# EAGLE design ArduitsyR3 (EAGLE 8.0.0)
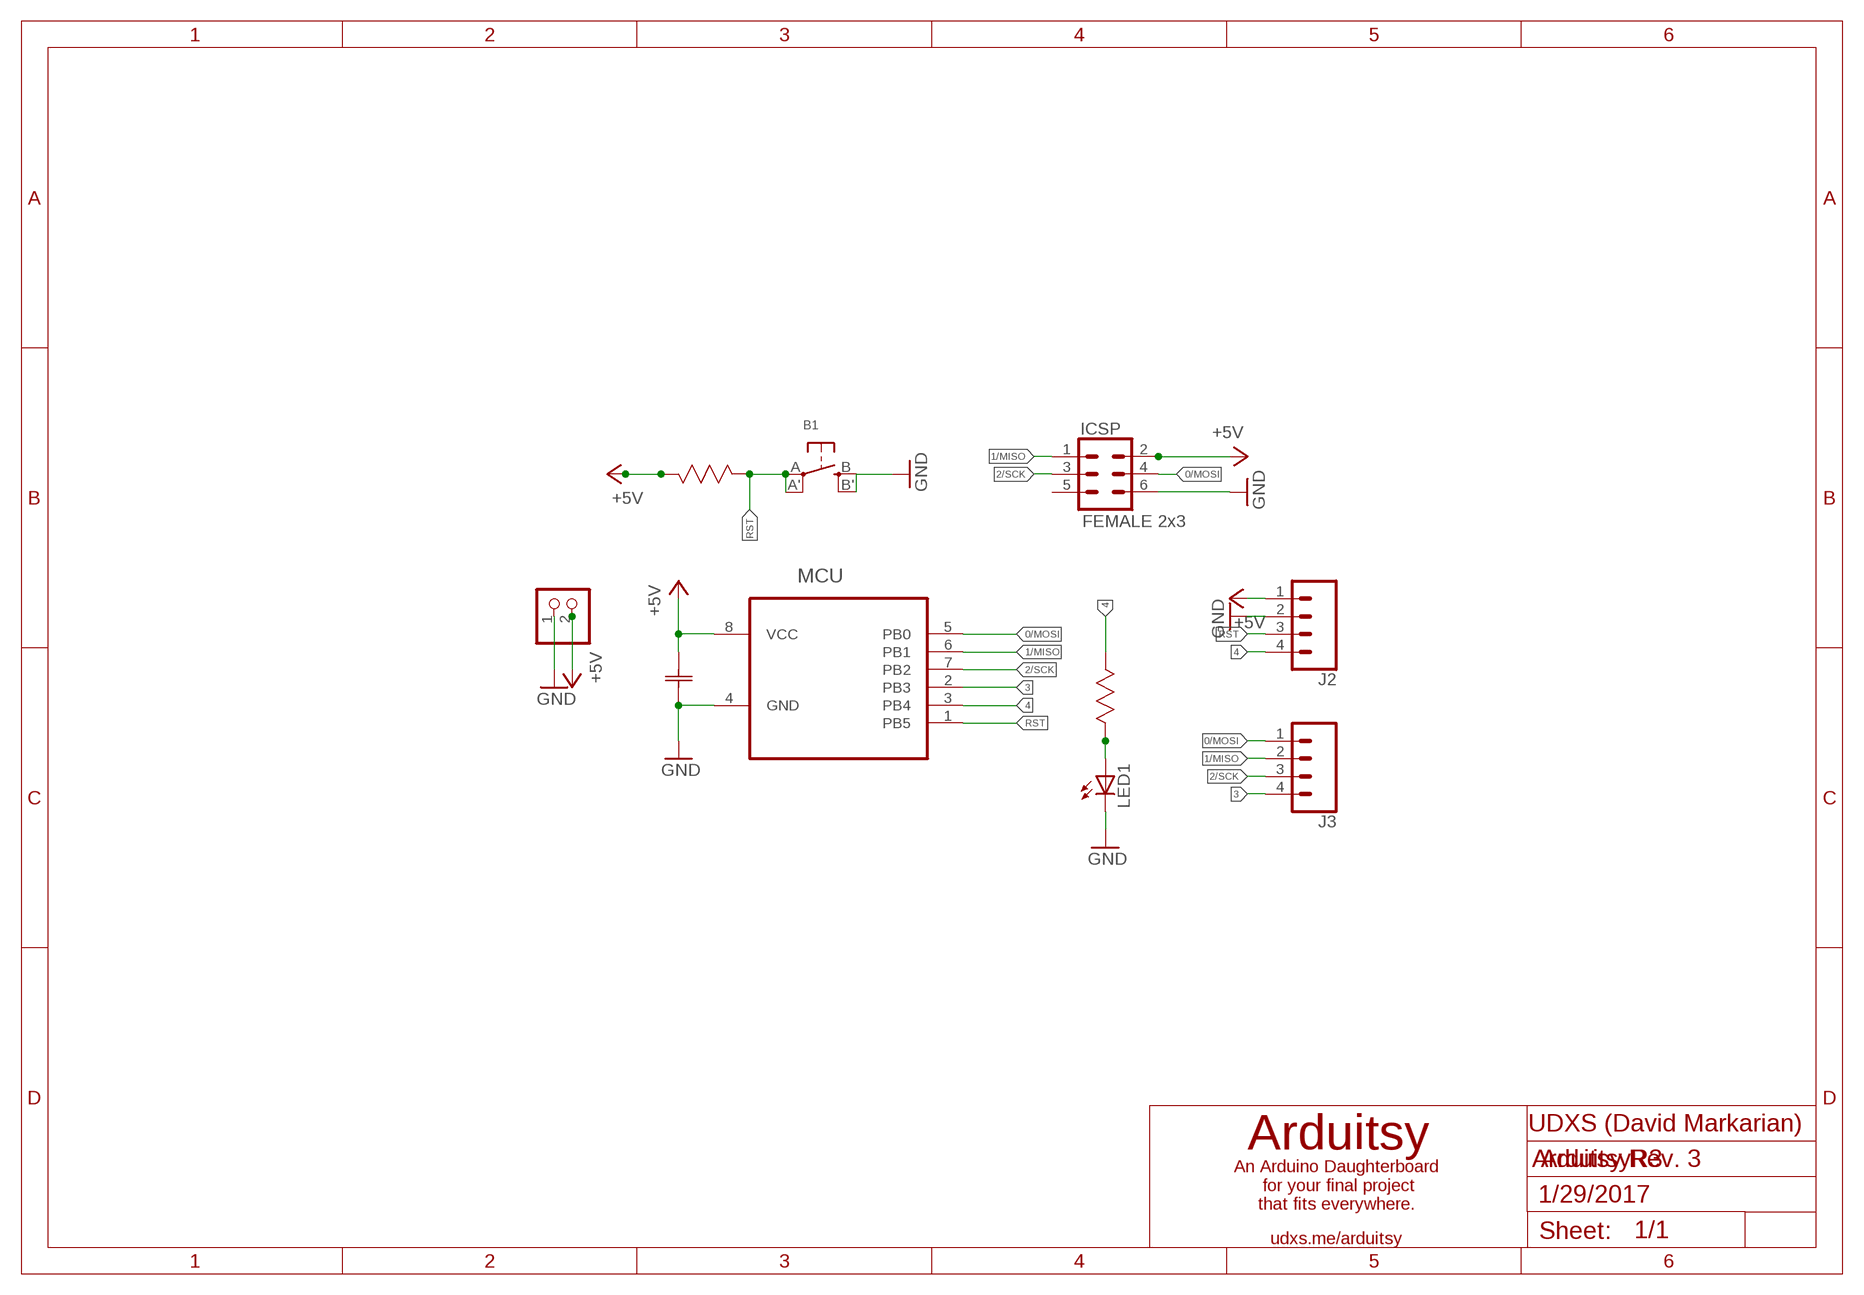
[diagram p0: schematic, sheet 1]

## Parts
B1  SWITCH_TACT_SMT  [EVQ-Q2]
C1  0.1µF  0805YC104KAT4A  [CAPC2012X94N]
CN1  JST_2PIN  [JSTPH2]
ICSP  FEMALE 2x3  CONN_03X2FEMALE  [2X3]
J2  CONN_04  [1X04]
J3  CONN_04  [1X04]
LED1  LEDCHIPLED_0805  [CHIPLED_0805]
MCU  ATTINY85-20SU  [SOIC127P798X216-8N]
R1  10K Ohms  MC0.1W08051%10K  [RESC2013X65N]
R2  10K Ohms  MC0.1W08051%10K  [RESC2013X65N]

## Nets
0/MOSI: ICSP.4 J3.1 MCU.5(PB0)
1/MISO: ICSP.1 J3.2 MCU.6(PB1)
2/SCK: ICSP.3 J3.3 MCU.7(PB2)
3: J3.4 MCU.2(PB3)
4: J2.4 MCU.3(PB4) R2.1(R1)
+5V: C1.1(C1) CN1.2 ICSP.2 J2.1 MCU.8(VCC) R1.1(R1)
GND: B1.B'(S1) B1.B(S) C1.2(C2) CN1.1 ICSP.6 J2.2 LED1.C MCU.4(GND)
N$1: LED1.A R2.2(R2)
RST: B1.A'(P1) B1.A(P) J2.3 MCU.1(PB5) R1.2(R2)
Unconnected: ICSP.5

## Notes on the sheet
- UDXS (David Markarian)
- Arduitsy
- Arduitsy Rev. 3
- An Arduino Daughterboard
   for your final project
  that fits everywhere.
- 1/29/2017
- udxs.me/arduitsy

## Library data of the parts
B1 = microbuilder:SWITCH_TACT_SMT: SMT Tact Switches 6x6mm - Digikey: P12940SCT-ND KMR2 (4.6x2.8mm) - Digikey: 401-1426-1-ND EVQ-PQHB55 - Light Touch, 160GF (4.5x4.5mm) - Digikey: P8090SCT-ND
C1 = AVX_By_element14_Batch_1:0805YC104KAT4A: Capacitor 0805; MPN: 0805YC104KAT4A; OC_FARNELL: -; OC_NEWARK: 30H0642; SUPPLIER: AVX; TOLERANCE: ±10%; VOLTAGERATING: 16V
CN1 = microbuilder:JST_2PIN: JST 2-Pin Right-Angle Connector PH-Series - 4UConnector: 17311 SH-Series - 4UConnector: 07278
ICSP = SparkFun-Connectors:CONN_03X2: Multi connection point. Often used as Generic Header-pin footprint for 0.1 inch spaced/style header connections You can populate with any combo of single row headers, but if you'd like an exact match, check these: Header - 2x3 (Male, 0.1") <https://www.sparkfun.com/products/12807> (PRT-12807) Header - 2x3 (Female, 0.1") <https://www.sparkfun.com/products/13010> (PRT-13010) 2x3 Pin Shrouded Header <https://www.sparkfun.com/products/10877> (PRT-10877) On any of the 0.1 inch spaced packages, you can populate with these: Break Away Headers - Straight <https://www.sparkfun.com/products/116> (PRT-00116) Break Away Male Headers - Right Angle <https://www.sparkfun.com/products/553> (PRT-00553) Female Headers <https://www.sparkfun.com/products/115> (PRT-00115) Break Away Headers - Machine Pin <https://www.sparkfun.com/products/117> (PRT-00117) Break Away Female Headers - Swiss Machine Pin <https://www.sparkfun.com/products/743> (PRT-00743) Special note: the shrouded connector mates well with our 3x2 ribbon cables: Ribbon Crimp Connector - 6-pin (2x3, Female) <https://www.sparkfun.com/products/10651> (PRT-10651) Ribbon Cable - 6 wire (15ft) <https://www.sparkfun.com/products/10646> (PRT-10646); PROD_ID: CONN-11566
J2 J3 = SparkFun-Connectors:CONN_04: Multi connection point. Often used as Generic Header-pin footprint for 0.1 inch spaced/style header connections On any of the 0.1 inch spaced packages, you can populate with these: Break Away Headers - Straight <https://www.sparkfun.com/products/116> (PRT-00116) Break Away Male Headers - Right Angle <https://www.sparkfun.com/products/553> (PRT-00553) Female Headers <https://www.sparkfun.com/products/115> (PRT-00115) Break Away Headers - Machine Pin <https://www.sparkfun.com/products/117> (PRT-00117) Break Away Female Headers - Swiss Machine Pin <https://www.sparkfun.com/products/743> (PRT-00743) For SCREWTERMINALS and SPRING TERMINALS visit here: Screw Terimnals on SparkFun.com <https://www.sparkfun.com/search/results?term=Screw+Terminals> (5mm/3.5mm/2.54mm spacing) This device is also useful as a general connection point to wire up your design to another part of your project. Our various solder wires solder well into these plated through hole pads. Hook-Up Wire - Assortment (Stranded, 22 AWG) <https://www.sparkfun.com/products/11375> (PRT-11375) Hook-Up Wire - Assortment (Solid Core, 22 AWG) <https://www.sparkfun.com/products/11367> (PRT-11367) View the entire wire category on our website here <https://www.sparkfun.com/categories/141> Special notes: Molex polarized connector foot print use with SKU : PRT-08231 with associated crimp pins and housings. 1MM SMD Version SKU: PRT-10208; PROD_ID: CONN-09696
LED1 = adafruit:LED: LED OSRAM: - CHIPLED LG R971, LG N971, LY N971, LG Q971, LY Q971, LO R971, LY R971 LH N974, LH R974 LS Q976, LO Q976, LY Q976 LO Q996 - Hyper CHIPLED LW Q18S LB Q993, LB Q99A, LB R99A - SideLED LS A670, LO A670, LY A670, LG A670, LP A670 LB A673, LV A673, LT A673, LW A673 LH A674 LY A675 LS A676, LA A676, LO A676, LY A676, LW A676 LS A679, LY A679, LG A679 - Hyper Micro SIDELED® LS Y876, LA Y876, LO Y876, LY Y876 LT Y87S - SmartLED LW L88C, LW L88S LB L89C, LB L89S, LG L890 LS L89K, LO L89K, LY L89K LS L896, LA L896, LO L896, LY L896 - TOPLED LS T670, LO T670, LY T670, LG T670, LP T670 LSG T670, LSP T670, LSY T670, LOP T670, LYG T670 LG T671, LOG T671, LSG T671 LB T673, LV T673, LT T673, LW T673 LH T674 LS T676, LA T676, LO T676, LY T676, LB T676, LH T676, LSB T676, LW T676 LB T67C, LV T67C, LT T67C, LS T67K, LO T67K, LY T67K, LW E67C LS E67B, LA E67B, LO E67B, LY E67B, LB E67C, LV E67C, LT E67C LW T67C LS T679, LY T679, LG T679 LS T770, LO T770, LY T770, LG T770, LP T770 LB T773, LV T773, LT T773, LW T773 LH T774 LS E675, LA E675, LY E675, LS T675 LS T776, LA T776, LO T776, LY T776, LB T776 LHGB T686 LT T68C, LB T68C - Hyper Mini TOPLED® LB M676 - Mini TOPLED Santana® LG M470 LS M47K, LO M47K, LY M47K Source: http://www.osram.convergy.de/
MCU = Atmel_By_element14_Batch_1-00:ATTINY85-20SU: 8-bit Microcontroller with In-System Programmable Flash; MPN: ATTINY85-20SU; OC_FARNELL: 1455164; OC_NEWARK: 58M3797; PACKAGE: SOIC-8; SUPPLIER: Atmel
R1 R2 = Multicomp_By_element14_Batch_1:MC0.1W08051%10K: RESISTOR, 0805; MPN: MC0.1W08051%10K; OC_FARNELL: 9332391; OC_NEWARK: -; SUPPLIER: Multicomp; TOLERANCE: ±1%; WATTAGE: 1/10 W

## Board
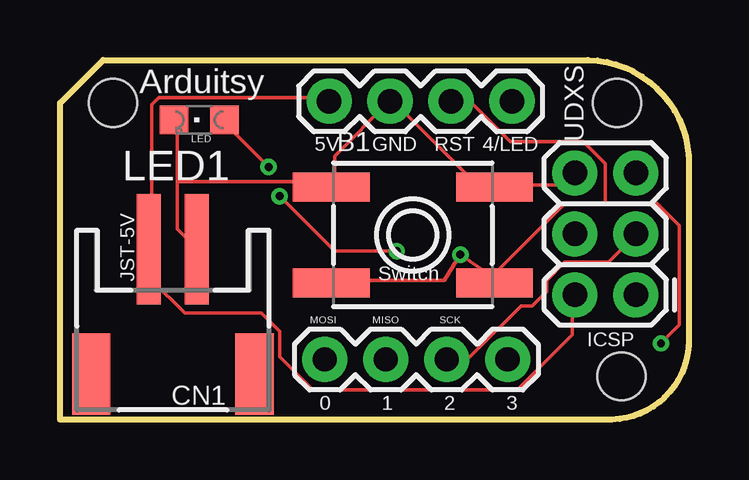
[diagram p1: board, top side]
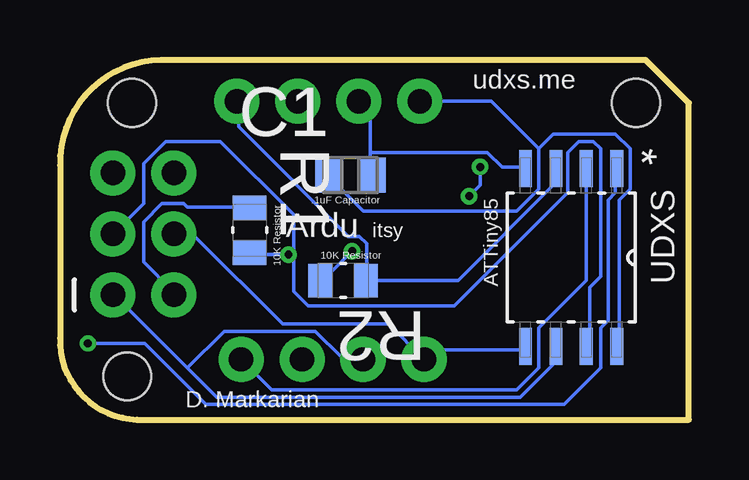
[diagram p2: board, bottom side, seen from below]

Size 26.2 x 15 mm. Coordinates in mm from the lower left corner, seen from the top.
Outline: 22,15 arc-90 26.2,10.6 26.2,3.4 arc-90 23,0 0,0 0,13.2 1.8,15 22,15
Copper layers (1*16): Top 0.0356mm / dielectric 1.5011mm / Bottom 0.0356mm
Design rules "PCBs_io": minimum track width 6mil, minimum drill 13mil, track to track 6mil, track to pad 6mil, pad to pad 6mil, via to via 6mil, smd to smd 6mil, copper to edge 15mil, drill to drill 6mil, minimum pad ring 7mil, minimum via ring 7mil, stop-mask expansion 3mil, vias tented up to drill 0mil, thermal gap 10mil
Holes 2 mm at 2.2,13.2 23.2,13.2 23.4,1.8

### Footprints (pad centres in the part's own frame; a part is rotated, then mirrored left to right if it is on the bottom)
EVQ-Q2 = smd 3.2 x 1.2: A -3.4,-2; A' 3.4,-2; B -3.4,2; B' 3.4,2
CAPC2012X94N = smd 1.118 x 1.448: 1 -0.914,0; 2 0.914,0
JSTPH2 = smd 1 x 4.6: 1 -1,-3.7; 2 1,-3.7 | smd 1.6 x 3.4: NC1 -3.4,1.5; NC2 3.4,1.5
2X3 = drill 1.016 pad 1.88: 1 0,0; 2 0,2.54; 3 2.54,0; 4 2.54,2.54; 5 5.08,0; 6 5.08,2.54
1X04 = drill 1.016 pad 1.88: 1 0,0; 2 2.54,0; 3 5.08,0; 4 7.62,0
CHIPLED_0805 = smd 1.2 x 1.2: A 0,-1.05; C 0,1.05
SOIC127P798X216-8N = smd 1.549 x 0.533: 1 -3.708,1.905; 2 -3.708,0.635; 3 -3.708,-0.635; 4 -3.708,-1.905; 5 3.708,-1.905; 6 3.708,-0.635; 7 3.708,0.635; 8 3.708,1.905
RESC2013X65N = smd 1.016 x 1.397: 1 -0.94,0; 2 0.94,0

### Placement (x,y rotation side)
B1  14.7,7.7 0 top
C1  14.1,10.2 0 bottom
CN1  4.7,3.4 180 top
ICSP  24,5.2 90 top
J2  11.21,13.28 0 top
J3  11.03,2.51 0 top
LED1  5.8,12.5 90 top
MCU  4.9,6.76 270 bottom
R1  18.3,7.9 270 bottom
R2  14.4,5.8 180 bottom

### Tracks (layer width: path | path; a pad name or v marks a point on that pad's centre or on a via)
0/MOSI
  Bottom 0.152: MCU.5 6.87,2.92 10.68,2.92 10.98,2.61 J3.1 12.51,3.98 16.93,3.98 20.58,7.64 21.35,7.64 ICSP.4
1/MISO
  Bottom 0.152: 20.89,2.15 23.94,5.2 ICSP.1 | 20.89,2.15 19.67,0.93 7.02,0.93 5.65,2.3 5.65,2.92 MCU.6 | 20.89,2.15 19.36,3.68 15.55,3.68 14.49,2.61 13.57,2.61 J3.2
2/SCK
  Top 0.152: J3.3 16.16,2.61 17.08,2.61 19.21,4.74 19.67,4.74 20.28,5.35 20.28,5.81 21.04,6.57 22.87,6.57 23.94,7.64 ICSP.3
  Bottom 0.152: MCU.7 4.12,3.07 4.12,5.51 3.67,5.96 3.67,11.3 3.97,11.6 4.58,11.6 5.04,11.14 5.04,9.47 9.76,4.74 15.86,4.74 16.47,5.35 16.47,8.55 19.52,11.6 21.8,11.6 22.72,10.69 22.72,9.01 23.94,7.79 ICSP.3
3
  Bottom 0.152: J3.4 17.38,1.24 7.17,1.24 6.26,2.15 6.26,3.83 4.28,5.81 4.28,10.38 MCU.2
4
  Bottom 0.152: 13.42,5.81 9.61,5.81 5.65,9.77 5.65,10.38 MCU.3 | 13.42,5.81 13.42,7.33 13.73,7.64 14.18,7.64 18.75,12.21 18.75,13.28 J2.4 | 13.42,5.81 R2.1
+5V
  Top 0.152: J2.1 11.14,13.28 10.98,13.43 4.12,13.43 3.82,13.13 3.82,7.18 CN1.2 3.82,7.03 3.82,5.81 5.19,4.44 8.39,4.44 9.15,3.68 9.15,2.61 10.53,1.24 19.06,1.24 21.35,3.52 21.35,5.2 ICSP.2
  Bottom 0.152: R1.1 18.45,8.86 20.89,8.86 21.04,9.01 21.96,9.01 22.72,8.25 22.72,6.57 21.5,5.35 ICSP.2 | 6.26,11.3 6.26,9.62 7.17,8.71 13.57,8.71 14.95,10.08 C1.1 | 6.26,11.3 8.24,13.28 J2.1 | 6.26,11.3 5.65,11.91 3.06,11.91 2.45,11.3 2.45,9.62 2.91,9.16 2.91,3.07 MCU.8
GND
  Top 0.152: 4.89,9.93 4.89,7.94 5.65,7.18 CN1.1 | 4.89,9.93 4.89,12.36 LED1.C | ICSP.6 21.35,10.23 20.89,9.77 18.15,9.77 B1.B' 17.99,9.77 17.38,9.77 13.88,13.28 J2.2 13.73,13.28 11.44,10.99 11.44,9.93 | 11.44,9.93 11.44,9.77 B1.B 11.44,9.93 | 11.44,9.93 4.89,9.93
  Bottom 0.152: 13.27,11.14 13.27,12.82 13.73,13.28 J2.2 | 13.27,11.14 13.27,10.23 C1.2 | 13.27,11.14 8.39,11.14 7.78,10.54 6.87,10.54 MCU.4
N$1  (via drill 0.33)
  Top 0.152: v8.7,10.54 6.87,12.36 LED1.A | v9.15,9.32 11.44,7.03 v14.03,7.03
  Bottom 0.152: v8.7,10.54 8.7,9.77 v9.15,9.32 | v14.03,7.03 15.25,5.81 R2.2
RST  (via drill 0.33)
  Top 0.152: 17.99,5.96 18.15,5.81 B1.A' 17.99,5.96 | 17.99,5.96 v16.68,6.88 16.01,5.81 11.44,5.81 B1.A | v25.04,3.18 25.81,3.94 25.81,8.1 24.89,9.01 22.72,9.01 | 22.72,9.01 21.04,9.01 17.99,5.96 | J2.3 17.08,13.28 18.75,11.6 21.8,11.6 22.72,10.69 22.72,9.01
  Bottom 0.152: v16.68,6.88 18.3,6.88 R1.2 | v25.04,3.18 22.68,3.18 20.13,0.63 5.19,0.63 3.67,2.15 3.67,3.83 3.36,4.13 3.36,9.16 3.06,9.47 3.06,10.38 MCU.1

### Text on the board
tPlace: UDXS | Arduitsy | LED | 5V | GND | RST | 4/LED | JST-5V | Switch | MOSI | MISO | SCK | ICSP | 0 | 1 | 2 | 3
bPlace: udxs.me | UDXS | .1uF Capacitor | itsy | Ardu | 10K Resistor | 10K Resistor | ATTiny85 | D. Markarian